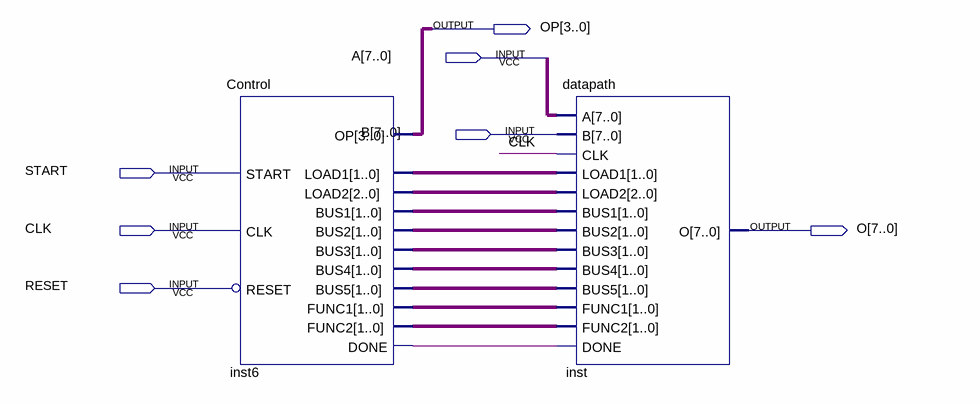
[diagram p0: schematic sheet]
// Quartus schematic piple.bdf as structural Verilog: 2 symbols, 7 pins
module piple (
  input  [7:0] A,
  input  [7:0] B,
  input  START,
  input  CLK,
  input  RESET,
  output [3:0] OP,
  output [7:0] O
);

  wire inst6_done;
  wire [1:0] inst6_bus1, inst6_bus2, inst6_bus3, inst6_bus4, inst6_bus5, inst6_func1, inst6_func2,
       inst6_load1;
  wire [2:0] inst6_load2;

  Control inst6 (
    .CLK(CLK), .RESET(~RESET), .START(START), .BUS1(inst6_bus1), .BUS2(inst6_bus2), .BUS3(inst6_bus3),
    .BUS4(inst6_bus4), .BUS5(inst6_bus5), .DONE(inst6_done), .FUNC1(inst6_func1), .FUNC2(inst6_func2),
    .LOAD1(inst6_load1), .LOAD2(inst6_load2), .OP(OP));
  datapath inst (
    .A(A), .B(B), .LOAD1(inst6_load1), .CLK(CLK), .BUS1(inst6_bus1), .FUNC1(inst6_func1), .BUS2(inst6_bus2),
    .BUS3(inst6_bus3), .LOAD2(inst6_load2), .BUS4(inst6_bus4), .DONE(inst6_done), .FUNC2(inst6_func2),
    .BUS5(inst6_bus5), .O(O));
endmodule
